# EAGLE design mainboard (EAGLE 6.6.0)
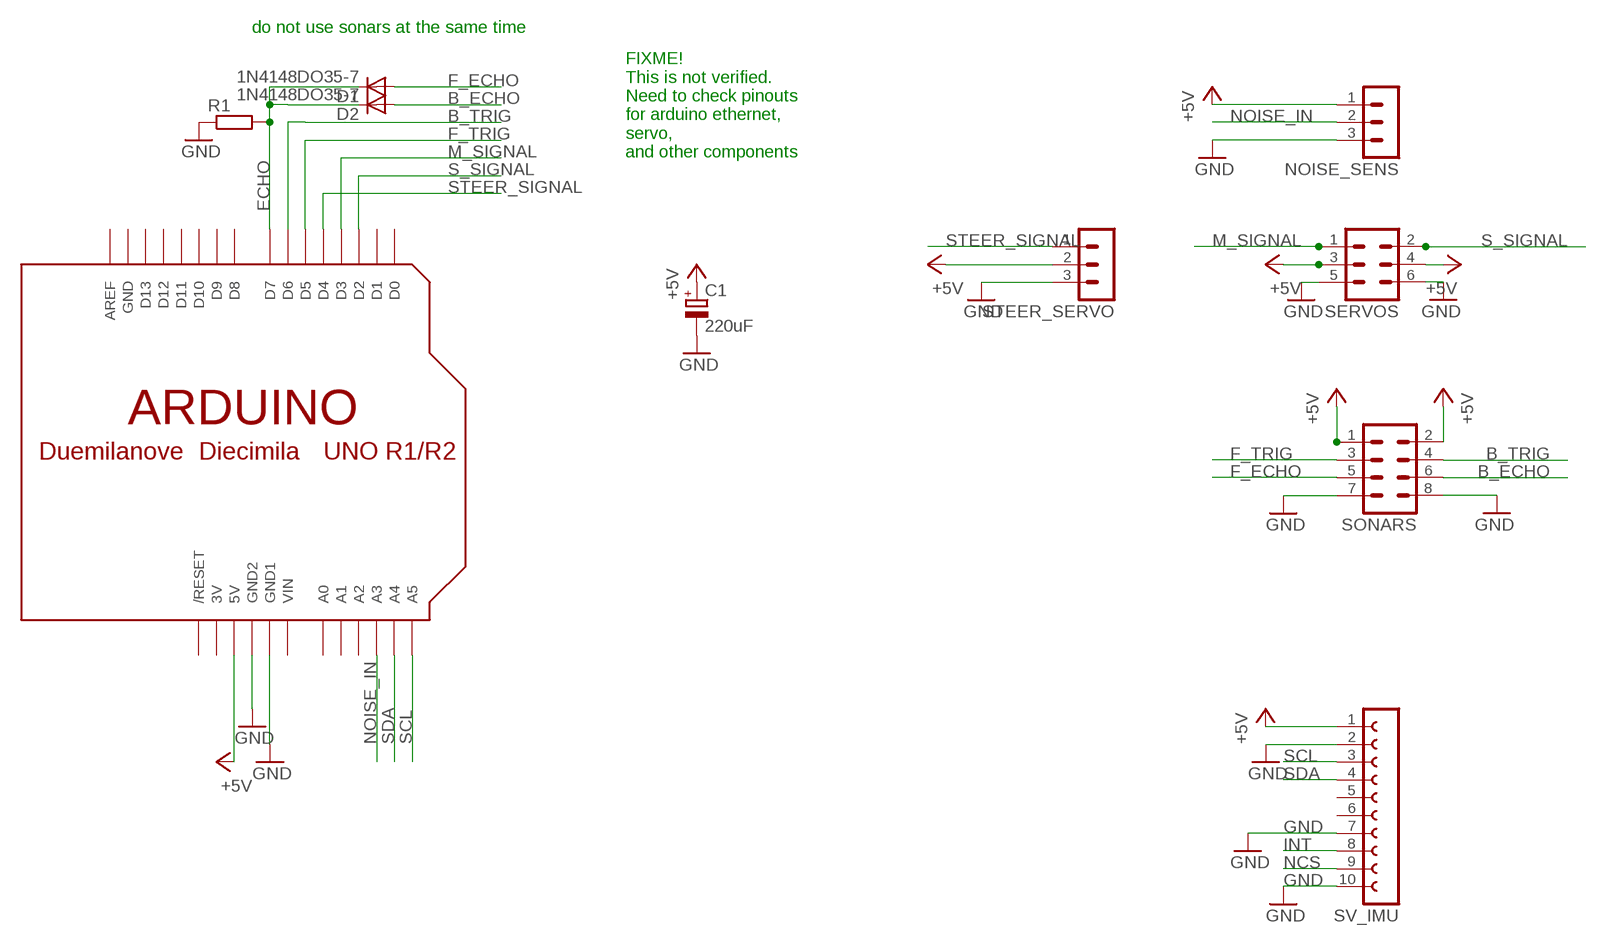
[diagram p0: schematic, sheet 1]

## Parts
C1  220uF  CPOL-EUE5-8.5  [E5-8,5]
D1  1N4148DO35-7  [DO35-7]
D2  1N4148DO35-7  [DO35-7]
NOISE_SENS  MA03-1  [MA03-1]
R1  R-EU_0204/2V  [0204V]
SERVOS  MA03-2  [MA03-2]
SONARS  MA04-2  [MA04-2]
STEER_SERVO  MA03-1  [MA03-1]
SV_IMU  FE10-1  [FE10]
U$1  ARDUINOUNO  [ARDUINO]

## Nets
+5V: C1.+ NOISE_SENS.1 SERVOS.3 SERVOS.4 SONARS.1 SONARS.2 STEER_SERVO.2 SV_IMU.1 U$1.5V
B_ECHO: D2.A SONARS.6
B_TRIG: SONARS.4 U$1.D6
ECHO: D1.C D2.C R1.2 U$1.D7
F_ECHO: D1.A SONARS.5
F_TRIG: SONARS.3 U$1.D5
GND: C1.- NOISE_SENS.3 R1.1 SERVOS.5 SERVOS.6 SONARS.7 SONARS.8 STEER_SERVO.3 SV_IMU.2 SV_IMU.7 SV_IMU.10 U$1.GND1 U$1.GND2
INT: SV_IMU.8
M_SIGNAL: SERVOS.1 U$1.D3
NCS: SV_IMU.9
NOISE_IN: NOISE_SENS.2 U$1.A3
S_SIGNAL: SERVOS.2 U$1.D2
SCL: SV_IMU.3 U$1.A5
SDA: SV_IMU.4 U$1.A4
STEER_SIGNAL: STEER_SERVO.1 U$1.D4
Unconnected: SV_IMU.5 SV_IMU.6 U$1.A0 U$1.A1 U$1.A2 U$1.AREF U$1.D0 U$1.D1 U$1.D8 U$1.D9 U$1.D10 U$1.D11 U$1.D12 U$1.D13 U$1.RESET(/RESET)

## Notes on the sheet
- do not use sonars at the same time
- FIXME!
  This is not verified.
  Need to check pinouts
  for arduino ethernet,
  servo,
  and other components

## Power pins joined to a net without a drawn wire
3V: U$1.3V
GND: U$1.GND
VIN: U$1.VIN

## Library data of the parts
C1 = rcl:CPOL-EU: POLARIZED CAPACITOR, European symbol
D1 D2 = diode:1N4148: DIODE high speed (Philips)
NOISE_SENS STEER_SERVO = con-lstb:MA03-1: PIN HEADER; OC_FARNELL: unknown; OC_NEWARK: unknown
R1 = rcl:R-EU_: RESISTOR, European symbol
SERVOS = con-lstb:MA03-2: PIN HEADER; OC_FARNELL: unknown; OC_NEWARK: unknown
SONARS = con-lstb:MA04-2: PIN HEADER; OC_FARNELL: unknown; OC_NEWARK: unknown
SV_IMU = con-lsta:FE10-1: FEMALE HEADER; OC_FARNELL: unknown; OC_NEWARK: unknown
U$1 = adafruit:ARDUINO: Arduino Diecimila/Duemilanove Make a shield with ease, this package has all the named pins as well as the two mounting drill holes and an outline of the USB and DC power connector. The outline is on the DIMENSION layer, so if your board house uses it they will cut the outline to match. http://www.ladyada.net/library/pcb/eaglelibrary.html

## Board
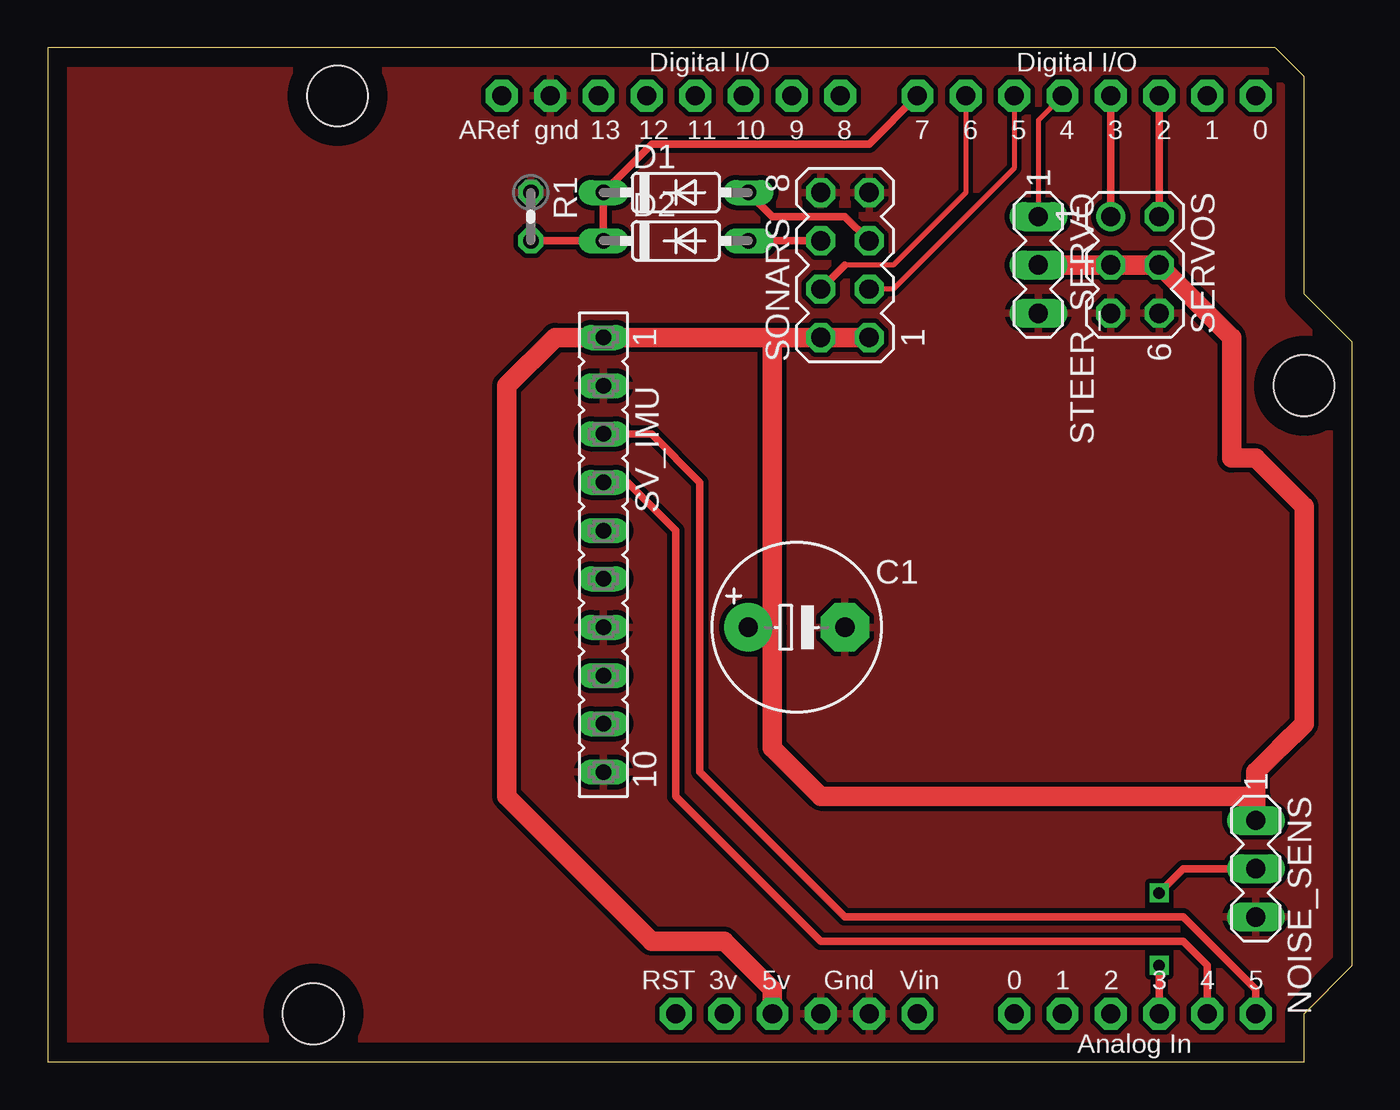
[diagram p1: board, top side]
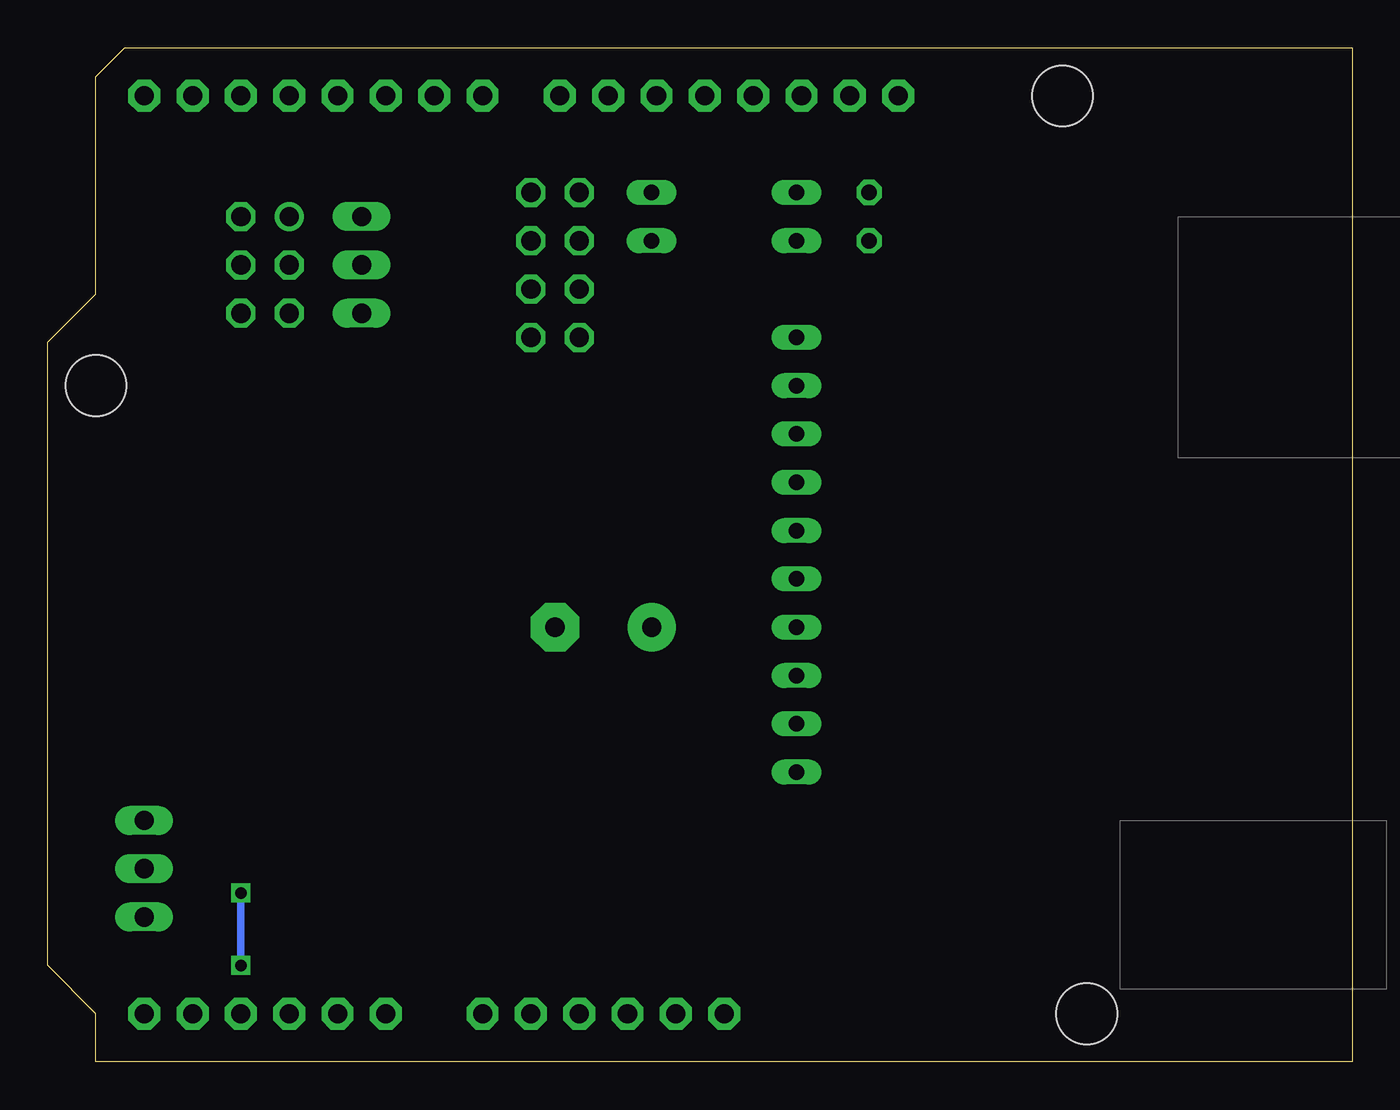
[diagram p2: board, bottom side, seen from below]

Size 68.58 x 53.34 mm. Coordinates in mm from the lower left corner, seen from the top.
Copper layers (1*16): Top 0.035mm / dielectric 1.5mm / Bottom 0.035mm
Design rules "default": minimum track width 10mil, minimum drill 24mil, track to track 8mil, track to pad 8mil, pad to pad 8mil, via to via 8mil, smd to smd 8mil, copper to edge 40mil, drill to drill 8mil, minimum pad ring 10mil, minimum via ring 8mil, stop-mask expansion 4mil, vias tented up to drill 0mil, thermal gap 10mil

### Footprints (pad centres in the part's own frame; a part is rotated, then mirrored left to right if it is on the bottom)
E5-8,5 = drill 1.016 pad 2.54: + -2.54,0 | drill 1.016 pad 2.54 octagon: - 2.54,0
DO35-7 = drill 0.813 long: A 3.81,0; C -3.81,0
MA03-1 = drill 1.016 long: 1 -2.54,0; 2 0,0; 3 2.54,0
0204V = drill 0.813 octagon: 1 -1.27,0; 2 1.27,0
MA03-2 = drill 1.016: 1 -2.54,-1.27 | drill 1.016 octagon: 2 -2.54,1.27; 3 0,-1.27; 4 0,1.27; 5 2.54,-1.27; 6 2.54,1.27
MA04-2 = drill 1.016 octagon: 1 -3.81,-1.27; 2 -3.81,1.27; 3 -1.27,-1.27; 4 -1.27,1.27; 5 1.27,-1.27; 6 1.27,1.27; 7 3.81,-1.27; 8 3.81,1.27
FE10 = drill 0.813 long: 1 -11.43,0; 2 -8.89,0; 3 -6.35,0; 4 -3.81,0; 5 -1.27,0; 6 1.27,0; 7 3.81,0; 8 6.35,0; 9 8.89,0; 10 11.43,0
ARDUINO = drill 1 pad 1.676 octagon: 3V 35.56,2.54; 5V 38.1,2.54; A0 50.8,2.54; A1 53.34,2.54; A2 55.88,2.54; A3 58.42,2.54; A4 60.96,2.54; A5 63.5,2.54; AREF 23.876,50.8; D0 63.5,50.8; D1 60.96,50.8; D2 58.42,50.8; D3 55.88,50.8; D4 53.34,50.8; D5 50.8,50.8; D6 48.26,50.8; D7 45.72,50.8; D8 41.656,50.8; D9 39.116,50.8; D10 36.576,50.8; D11 34.036,50.8; D12 31.496,50.8; D13 28.956,50.8; GND 26.416,50.8; GND1 43.18,2.54; GND2 40.64,2.54; RESET 33.02,2.54; VIN 45.72,2.54 | hole 3.2: 15.24,50.8; 66.04,35.56; 13.97,2.54

### Placement (x,y rotation side)
C1  39.37,22.86 0 top
D1  33.02,45.72 0 top
D2  33.02,43.18 0 top
NOISE_SENS  63.5,10.16 270 top
R1  25.4,44.45 270 top
SERVOS  57.15,41.91 270 top
SONARS  41.91,41.91 90 top
STEER_SERVO  52.07,41.91 270 top
SV_IMU  29.21,26.67 270 top
U$1  0,0 0 top

### Tracks (layer width: path | path; a pad name or v marks a point on that pad's centre or on a via)
+5V
  Top 1.016: U$1.5V 38.1,3.81 35.56,6.35 31.75,6.35 24.13,13.97 24.13,35.56 26.67,38.1 SV_IMU.1 33.02,38.1 35.56,38.1 38.1,38.1 | 38.1,22.86 38.1,16.51 40.64,13.97 63.5,13.97 | 38.1,22.86 38.1,38.1 | NOISE_SENS.1 63.5,13.97 | 63.5,13.97 63.5,15.24 64.77,16.51 66.04,17.78 66.04,29.21 63.5,31.75 62.23,31.75 62.23,38.1 SERVOS.4 | SONARS.1 SONARS.2 38.1,38.1 | SERVOS.4 SERVOS.3 | SERVOS.3 SERVOS.4 | C1.+ 38.1,22.86 | SERVOS.3 STEER_SERVO.2
B_ECHO
  Top 0.406: SONARS.6 D2.A
B_TRIG
  Top 0.254: 41.91,41.91 44.45,41.91 48.26,45.72 U$1.D6
  Top 0.406: SONARS.4 41.91,41.91
ECHO
  Top 0.406: U$1.D7 43.18,48.26 31.75,48.26 D1.C D2.C R1.2
F_ECHO
  Top 0.406: SONARS.5 41.91,44.45 38.1,44.45 D1.A
F_TRIG
  Top 0.254: SONARS.3 44.45,40.64 50.8,46.99 U$1.D5
GND
  pour Top (isolate 0.254): 0,53.34 68.58,53.34 68.58,0 0,0
M_SIGNAL
  Top 0.406: SERVOS.1 U$1.D3
NOISE_IN  (via drill 0.6)
  Top 0.406: NOISE_SENS.2 59.69,10.16 v58.42,8.89 | U$1.A3 v58.42,5.08
  Bottom 0.406: v58.42,8.89 v58.42,5.08
S_SIGNAL
  Top 0.406: SERVOS.2 U$1.D2
SCL
  Top 0.406: U$1.A5 63.5,3.81 59.69,7.62 41.91,7.62 34.29,15.24 34.29,30.48 31.75,33.02 SV_IMU.3
SDA
  Top 0.406: U$1.A4 60.96,5.08 59.69,6.35 40.64,6.35 33.02,13.97 33.02,27.94 30.48,30.48 SV_IMU.4
STEER_SIGNAL
  Top 0.254: STEER_SERVO.1 52.07,49.53 U$1.D4